# Altium schematic sheet FrontLightsFinal.SchDoc
size Letter; SheetNumber: 1; SheetTotal: 1; SPICEModelCacheMZOYMRSE: <root> / <DocumentId>MZOYMRSE</DocumentId> / </root>
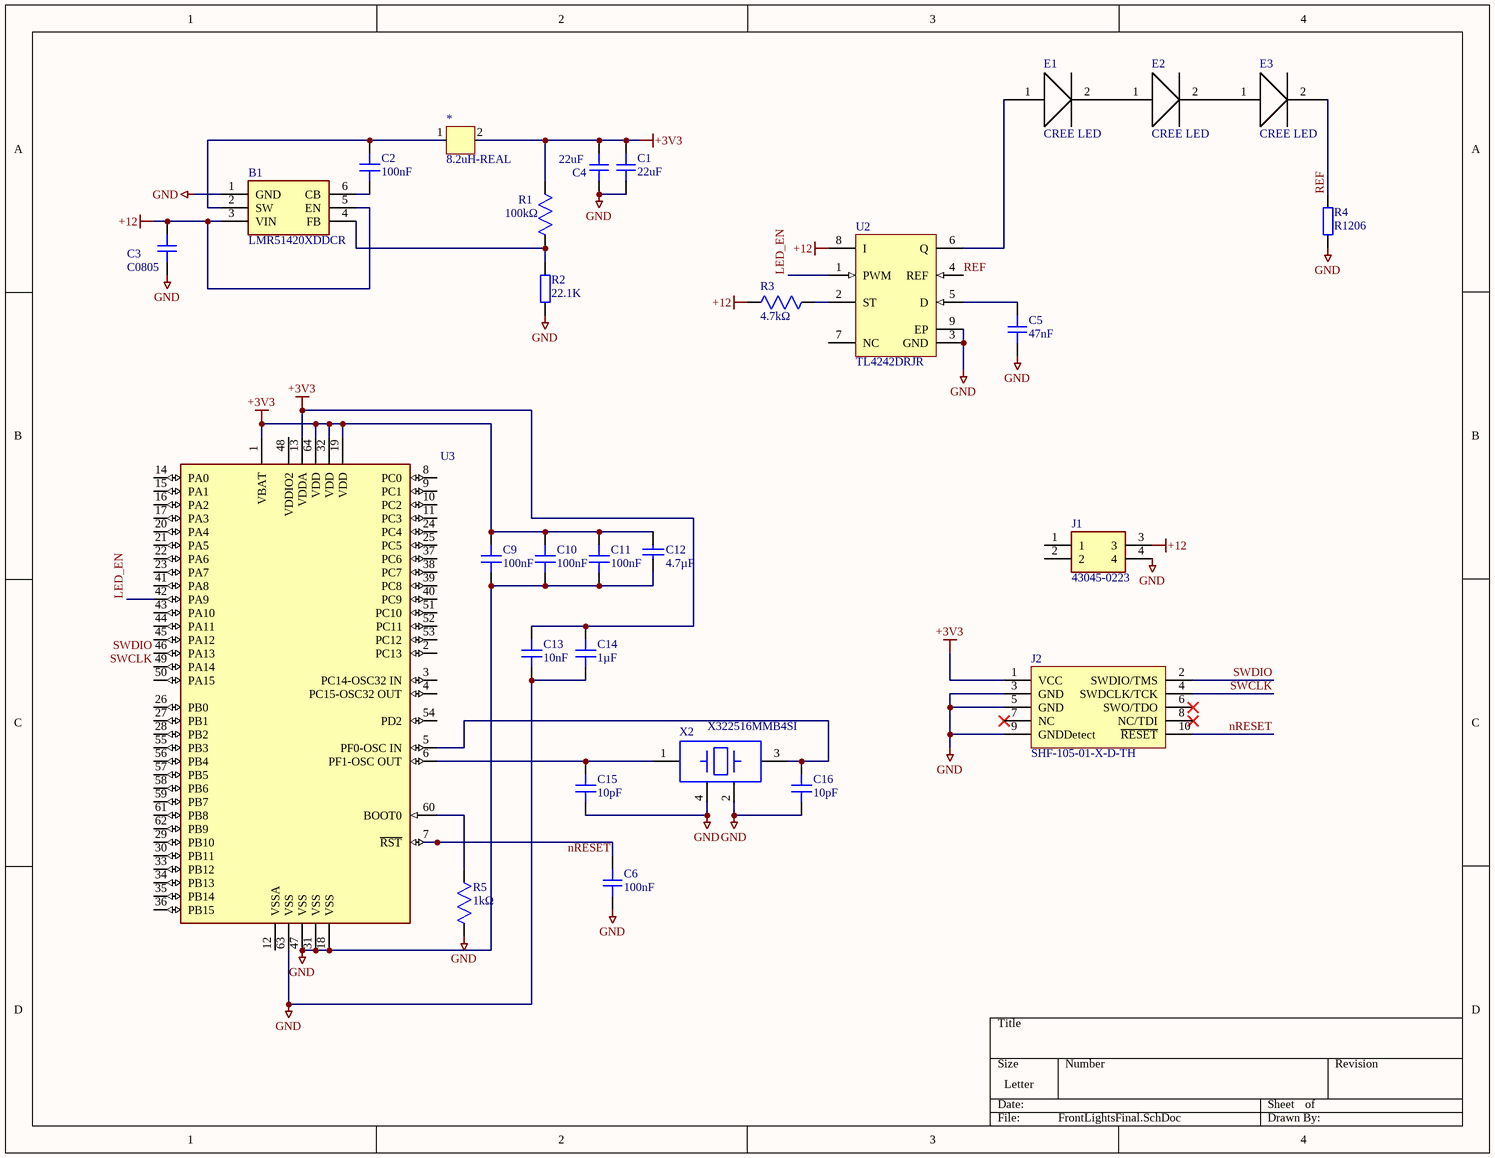
[diagram p0: FrontLightsFinal.SchDoc]

## Parts
*  8.2uH-REAL  [DR73]
B1  LMR51420XDDCR  [SOT95P280X110-6N]
C1  22uF  [CAP_0603]
C2  value 100nF  [CAP_0603]  (hidden comment: 0603YC104J4T4A)
C3  C0805  [CAP_0805]
C4  22uF  [CAP_0603]
C5  47nF  [CAP_0603]
C6  100nF  [CAP_0603]
C9  value 100nF  [CAP_0603]  (hidden comment: 0603YC104J4T4A)
C10  value 100nF  [CAP_0603]  (hidden comment: 0603YC104J4T4A)
C11  value 100nF  [CAP_0603]  (hidden comment: 0603YC104J4T4A)
C12  value 4.7µF  [CAP_1206]  (hidden comment: 1206B475K500NT)
C13  value 10nF  [C0402]  (hidden comment: C0402C103M4RACTU)
C14  value 1µF  [CAP_0402]  (hidden comment: CL05A105KA5NQNC)
C15  value 10pF  [CAP_0402]  (hidden comment: CL05C100JB5NNNC)
C16  value 10pF  [CAP_0402]  (hidden comment: CL05C100JB5NNNC)
E1  CREE LED  [PCBComponent_1]
E2  CREE LED  [PCBComponent_1]
E3  CREE LED  [PCBComponent_1]
J1  43045-0223  [43045-02YY_212223]
J2  SHF-105-01-X-D-TH  [SAMTEC_SHF-105-01-X-D-TH]
R1  value 100kΩ  [RES_0805]  (hidden comment: 0805W8F1003T5E)
R2  22.1K  [RES_0805]
R3  value 4.7kΩ  [RES_0402]  (hidden comment: RT0402FRE074K7L)
R4  R1206  [RES_1206]
R5  value 1kΩ  [RES_0603]  (hidden comment: RT0603FRE131KL)
U2  TL4242DRJR  [DRJ0008A_V]
U3  STM32F072RBT7  [LQFP-64-0.5mm]  (value not drawn)
X2  X322516MMB4SI  [830207658809]

## Nets
+3V3: *.2 C1.2 C4.2 C9.2 C10.2 C11.2 C12.2 C13.2 C14.2 J2.1(VCC) R1.2 U3.1(VBAT) U3.13(VDDA) U3.19(VDD) U3.32(VDD) U3.64(VDD)
+12: B1.3(VIN) B1.5(EN) C3.2 J1.3 R3.1 U2.8(I)
GND: B1.1(GND) C1.1 C3.1 C4.1 C5.1 C6.1 C9.1 C10.1 C11.1 C12.1 C13.1 C14.1 C15.2 C16.2 J1.4 J2.3(GND) J2.5(GND) J2.9(GNDDetect) R2.1 R4.1 R5.1 U2.3(GND) U2.9(EP) U3.18(VSS) U3.31(VSS) U3.47(VSS) U3.63(VSS) X2.2(GND) X2.4(+VS)
LED_EN: U2.1(PWM) U3.42(PA9)
nRESET: C6.2 J2.10(~{RESET}) U3.7(~{RST})
REF: E3.2 R4.2 U2.4(REF)
SWCLK: J2.4(SWDCLK/TCK) U3.49(PA14)
SWDIO: J2.2(SWDIO/TMS) U3.46(PA13)
Net*_1: *.1 B1.2(SW) C2.2
NetB1_4: B1.4(FB) R1.1 R2.2
NetB1_6: B1.6(CB) C2.1
NetC5_2: C5.2 U2.5(D)
NetC15_1: C15.1 U3.6(PF1-OSC_OUT) X2.1(ENABLE/DISABLE)
NetC16_1: C16.1 U3.5(PF0-OSC_IN) X2.3(OUTPUT)
NetE1_1: E1.1 U2.6(Q)
NetE1_2: E1.2 E2.1
NetE2_2: E2.2 E3.1
NetR3_2: R3.2 U2.2(ST)
NetR5_2: R5.2 U3.60(BOOT0)

Not connected (* = marked no-connect by the designer): J1 1 2; J2 6(SWO/TDO)* 7(NC)* 8(NC/TDI)*; U2 7(NC); U3 2(PC13) 3(PC14-OSC32_IN) 4(PC15-OSC32_OUT) 8(PC0) 9(PC1) 10(PC2) 11(PC3) 12(VSSA) 14(PA0) 15(PA1) 16(PA2) 17(PA3) 20(PA4) 21(PA5) 22(PA6) 23(PA7) 24(PC4) 25(PC5) 26(PB0) 27(PB1) 28(PB2) 29(PB10) 30(PB11) 33(PB12) 34(PB13) 35(PB14) 36(PB15) 37(PC6) 38(PC7) 39(PC8) 40(PC9) 41(PA8) 43(PA10) 44(PA11) 45(PA12) 48(VDDIO2) 50(PA15) 51(PC10) 52(PC11) 53(PC12) 54(PD2) 55(PB3) 56(PB4) 57(PB5) 58(PB6) 59(PB7) 61(PB8) 62(PB9)

## Library data of the parts
B1 = LMR51420XDDCR: Switching Voltage Regulators SIMPLE SWITCHER power converter 4.5-V to 36-V, 2-A, synchronous buck with 40-uA IQ; Manufacturer_Name: Texas Instruments; Geometry.Height: 1.1mm; Mouser Part Number: 595-LMR51420XDDCR; Mouser Price/Stock: https://www.mouser.co.uk/ProductDetail/Texas-Instruments/LMR51420XDDCR?qs=vvQtp7zwQdN6fBqQU4azxw%3D%3D; Manufacturer_Part_Number: LMR51420XDDCR; Datasheet Link: https://www.ti.com/lit/ds/symlink/lmr51420.pdf?ts=1663231243064
C1 C4 C5 = CAP_0603: Capacitor SMD 0603; Manufacturer: *; Manufacturer Part Number: *; Distributor Link: *; LCSC: *; Rating: *; Dielectric: *
C2 C9-C11 = CMP-001-00084-3: 0.1uF 16V X7R 5% 0603T/R; Capacitor Type: Ceramic Capacitor X7R; Mounting Technology: SMD; Case/Package: 0603; RoHS Compliant: Yes
C3 = CAP_0805: Capacitor SMD 0805; Manufacturer: *; Manufacturer Part Number: *; Distributor Link: *; LCSC: *; Rating: *; Dielectric: *
C6 = CAP_0603_16V: Capacitor SMD 0603 16V
C12 = CMP-001-00145-1: 4.7uF 50V X7R ±10% 1206 Multilayer Ceramic Capacitors MLCC - SMD/SMT ROHS; Voltage Rating: 50V; JLCPCB Part #: C29823
C13 = CMP-001-00094-2: 10nF 16V X7R 0402 20%; Capacitor Type: Ceramic; Tolerance: 20%; Max Operating Temperature: 125°C; Mounting Technology: Surface Mount; Case/Package: 0402; RoHS Compliant: Yes; Voltage Rating: 16V; Pins: 2; Min Operating Temperature: -55°C
C14 = CMP-001-00085-4: 1uF 25V X5R 0402; Tolerance: 10%; Case/Package: 0402; JLCPCB Part #: C52923; Min Operating Temperature: -55°C; Mounting Technology: Surface Mount; Max Operating Temperature: 85°C; Voltage Rating: 25V; RoHS Compliant: Yes
C15 C16 = CMP-001-00115-1: 10pF 0402 50V C0G 5% MLCC; Capacitor Type: Ceramic; RoHS Compliant: Yes; Pins: 2; Max Operating Temperature: 125°C; Case/Package: 0402; Min Operating Temperature: -55°C; Tolerance: 5%; Voltage Rating: 50V; Mounting Technology: Surface Mount; JLCPCB Part #: C32949
J1 = CMP-002-00092-2: 2 Pos. Micro-Fit 3.0 Right-Angle Header; Manufacturer_Name: Molex; Height: 8.77mm; Mouser Part Number: 538-43045-0223; Manufacturer_Part_Number: 43045-0223; Source: SamacSys.SchLib; Datasheet Link: https://www.molex.com/pdm_docs/sd/430450221_sd.pdf; Mouser Price/Stock: https://www.mouser.co.uk/ProductDetail/Molex/43045-0223?qs=vFIbPToLYxJo8rgMyoDzIw%3D%3D; Design Item ID: 43045-0223
J2 = CMP-002-00085-3: JTAG 10-Pin Header 1.27mm; MF: Samtec; Source: SHF-105-01-X-D-TH.SchLib; Value: *; Price: None; Pins: 10; Design Item ID: SHF-105-01-X-D-TH; Component Type: Standard; Availability: Unavailable; MP: SHF-105-01-X-D-TH; Case/Package: None
R1 = CMP-009-00203-1: 100kΩ 0805 Thick Film 125mW 1% 150V; Max Operating Temperature: 155°C; JLCPCB Part #: C149504; RoHS Compliant: Yes; Min Operating Temperature: -55°C; Mounting Technology: Surface Mount; Tolerance: 1%; Pins: 2; Case/Package: 0805; Power: 125mW; Voltage Rating: 150V
R2 = RES_0805: Resistor SMD 0805; Manufacturer: *; Manufacturer Part Number: *; Distributor Link: *; LCSC: *
R3 = CMP-009-00193-1: 4.7kΩ 0402 Thin Film 62.5mW 1% 50V; Max Operating Temperature: 155°C; Pins: 2; Power: 62.5mW; RoHS Compliant: Yes; Tolerance: 1%; Case/Package: 0402; Min Operating Temperature: -55°C; Voltage Rating: 50V; Mounting Technology: Surface Mount
R4 = RES_1206: Resistor SMD 1206; Manufacturer: *; Manufacturer Part Number: *; Distributor Link: *; LCSC: *
R5 = CMP-009-00182-2: 1k 0603 Thin Film Res 1% 1/10W ±50ppm/°C Molded SMD Paper T/R; Voltage Rating: 75V; Max Operating Temperature: 125°C; Tolerance: 1%; RoHS Compliant: Yes; Case/Package: 0603; Min Operating Temperature: -55°C
U2 = CMP-0388-00226-2: Adjustable LED Driver, 4.5 to 42 V, -40 to 150 degC, 8-pin SON (DRJ8), Green (RoHS & no Sb/Br); Manufacturer: Texas Instruments; Rating: Catalog; Vin(Min)(V): 4.5; Vin(Max)(V): 42; PackageReference: DRJ0008A; ComponentLink2Description: Datasheet; ComponentLink2URL: http://www.ti.com/general/docs/lit/getliterature.tsp?genericPartNumber=TL4242&fileType=pdf; ComponentLink3URL: http://www.ti.com/lit/ds/symlink/sn55hvd251.pdf; PartNumber: TL4242DRJR; PackageVersion: 4205439/C; Mounting Technology: Surface Mount; DatasheetVersion: SLVS641A; ComponentLink1URL: http://www.ti.com/; SubFamily: LED Driver; PackageDescription: 8-Pin Plastic Small Outline, Body 4 x 4 mm, Pitch 0.8 mm; ComponentLink3Description: Package Specification; Eco-Plan: Green (RoHS & no Sb/Br); Code_JEDEC: MO-229; ComponentLink1Description: Manufacturer URL
U3 = CMP-020-00026-1: MCU 32-Bit ARM Cortex-M0 RISC 64KB Flash 2V to 3.6V 64-Pin LQFP Tray; Frequency: 48MHz; Interface: I2C,SPI,USB,HDMI,IrDA,UART,USART; Mounting Technology: Surface Mount; Min Operating Temperature: -40°C; Case/Package: LQFP; Max Operating Temperature: 105°C
X2 = CMP-018-000014-4: 16MHz Oscillator 10pF 10ppm 3.2 x 2.5mm; Manufacturer_Name: YXC; Mouser Price/Stock: https://www.mouser.co.uk/ProductDetail/Wurth-Elektronik/830207658809?qs=hWgE7mdIu5QE%2FCurpvqJsA%3D%3D; Design Item ID: 830207658809; Mouser Part Number: 710-830207658809; JLCPCB Part #: C112972; Load Capacitance: 10pF; Manufacturer_Part_Number: X322516MMB4SI; Height: 1.2mm; Frequency: 16MHz; Source: SamacSys.SchLib; Case/Package: 3.2mm x 2.5mm; Datasheet Link: https://www.we-online.com/catalog/datasheet/830207658809.pdf